# Altium project ESP-Logger.PrjPcb
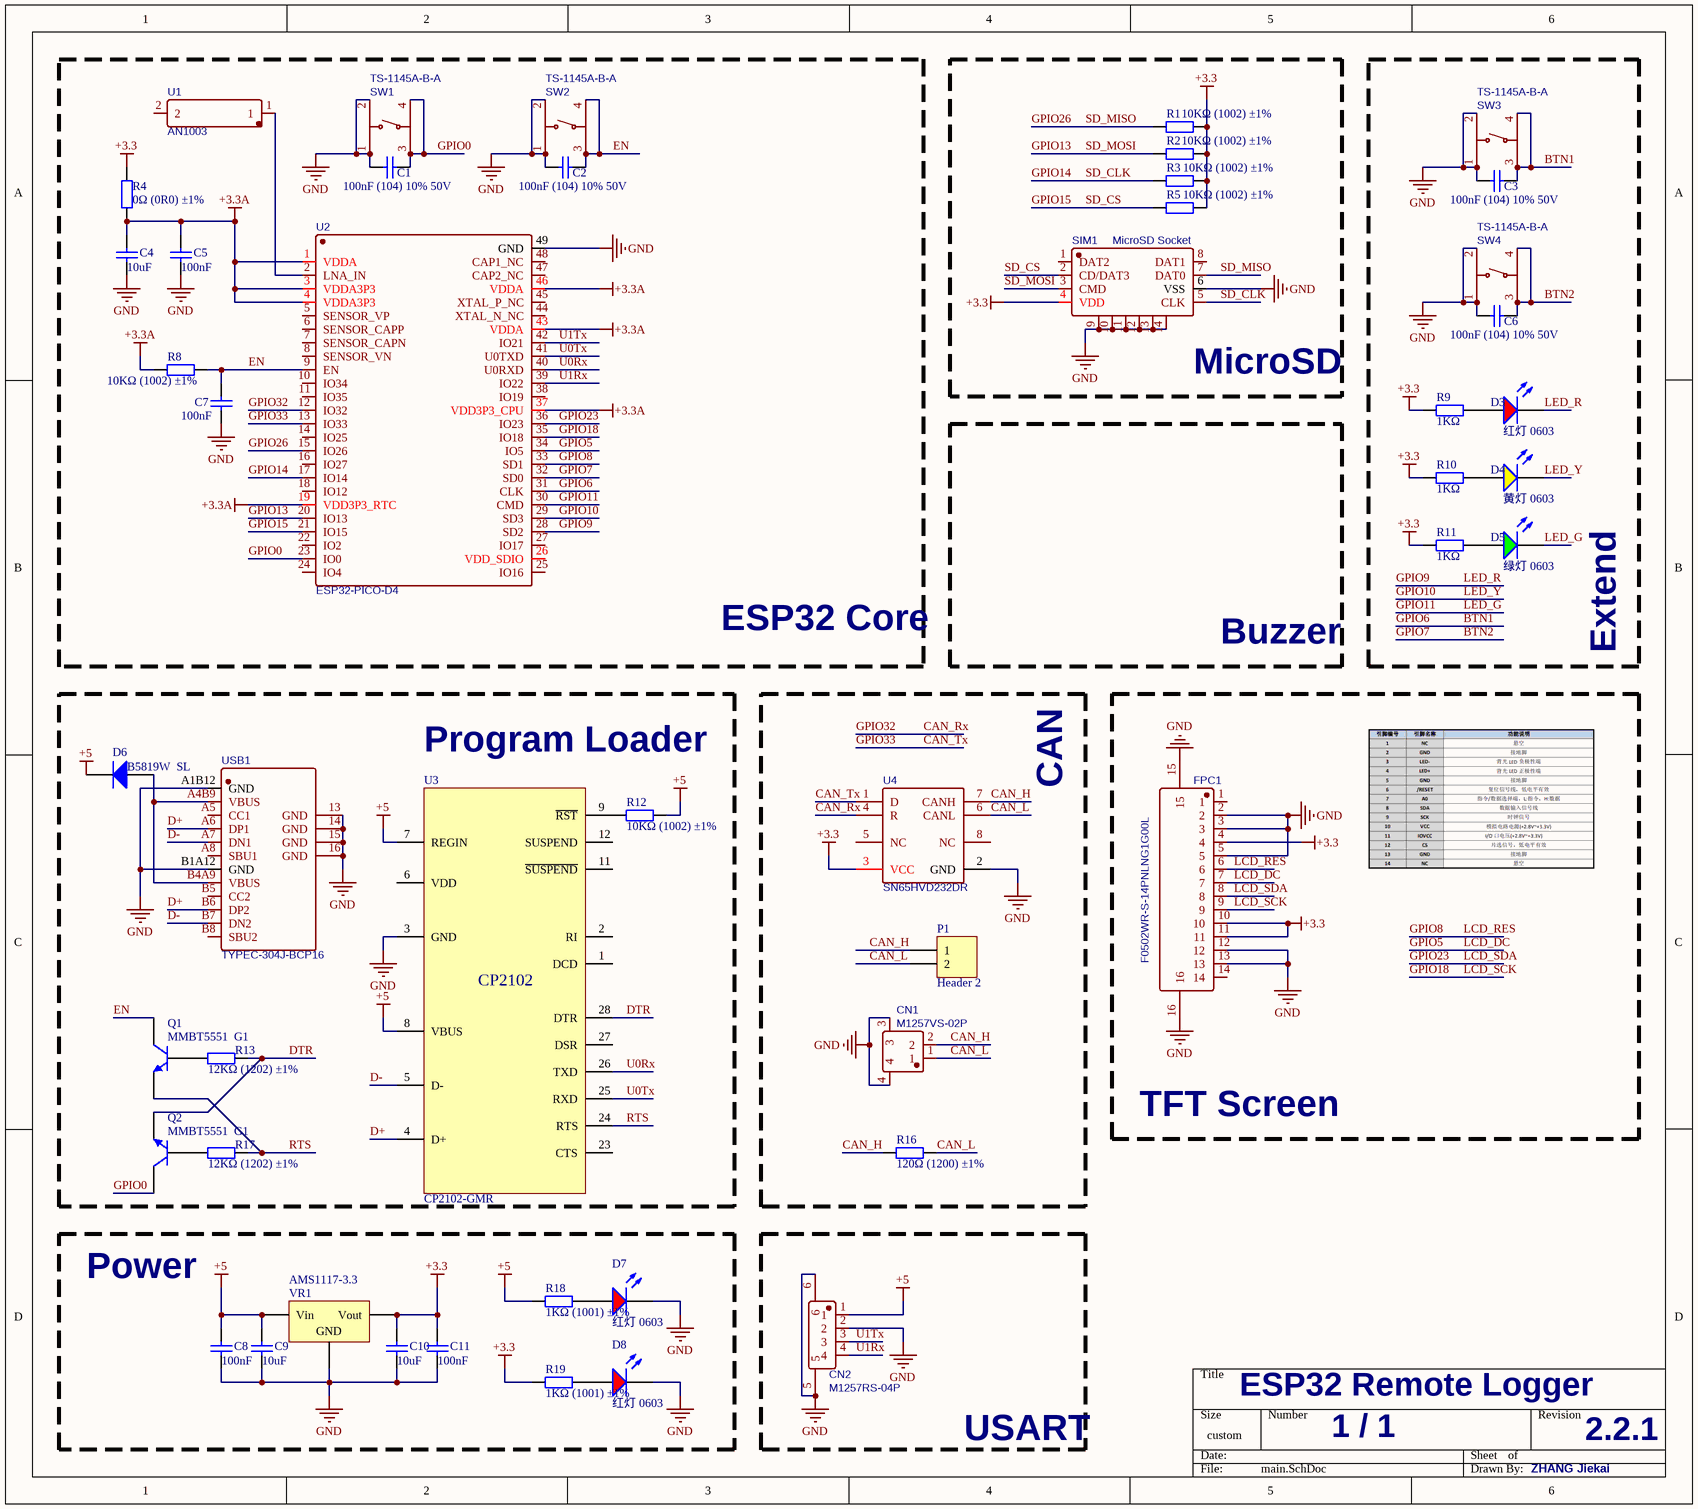
[diagram p0: main.SchDoc]
1 sheet, 49 parts. Net scope: global (net labels, ports and power ports of the same name join across sheets).
Board files: gen1.PcbDoc, gen2.PcbDoc

## Sheet main.SchDoc
size 317 x 281 mm; SheetNumber: 1; SheetTotal: 1

### Parts
C1  100nF (104) 10% 50V  [0603_C]
C2  100nF (104) 10% 50V  [0603_C]
C3  100nF (104) 10% 50V  [0603_C]
C4  10uF  [0603_C]
C5  100nF  [0603_C]
C6  100nF (104) 10% 50V  [0603_C]
C7  100nF  [0603_C]
C8  100nF  [0603_C]
C9  10uF  [0603_C]
C10  10uF  [0603_C]
C11  100nF  [0603_C]
CN1  M1257VS-02P  [CONN-SMD_P1.25_M1257VS-02P]
CN2  M1257RS-04P  [CONN-SMD_M1257RS-04P]
D3  红灯 0603  [0603_LED_S1]
D4  黄灯 0603  [0603_LED_S1]
D5  绿灯 0603  [0603_LED_S1]
D6  B5819W  SL  [SOD-123]
D7  红灯 0603  [0603_LED_S1]
D8  红灯 0603  [0603_LED_S1]
FPC1  F0502WR-S-14PNLNG1G00L  [FPC-SMD_P0.50-14P_F0500WR-S]
P1  Header 2  [HDR1X2]
Q1  MMBT5551  G1  [SOT-23(SOT-23-3)]
Q2  MMBT5551  G1  [SOT-23(SOT-23-3)]
R1  10KΩ (1002) ±1%  [0603_R]
R2  10KΩ (1002) ±1%  [0603_R]
R3  10KΩ (1002) ±1%  [0603_R]
R4  0Ω (0R0) ±1%  [0603_R]
R5  10KΩ (1002) ±1%  [0603_R]
R8  10KΩ (1002) ±1%  [0603_R]
R9  1KΩ  [0603_R]
R10  1KΩ  [0603_R]
R11  1KΩ  [0603_R]
R12  10KΩ (1002) ±1%  [0603_R]
R13  12KΩ (1202) ±1%  [0603_R]
R16  120Ω (1200) ±1%  [0603_R]
R17  12KΩ (1202) ±1%  [0603_R]
R18  1KΩ (1001) ±1%  [0603_R]
R19  1KΩ (1001) ±1%  [0603_R]
SIM1  MicroSD Socket  [SIM-SMD_8P-1040310811]
SW1  TS-1145A-B-A  [SW-SMD_4P-L4.2-W3.2-P2.15-LS5.2]
SW2  TS-1145A-B-A  [SW-SMD_4P-L4.2-W3.2-P2.15-LS5.2]
SW3  TS-1145A-B-A  [SW-SMD_4P-L4.2-W3.2-P2.15-LS5.2]
SW4  TS-1145A-B-A  [SW-SMD_4P-L4.2-W3.2-P2.15-LS5.2]
U1  AN1003  [ANT-SMD_L10.3-W3.0]
U2  ESP32-PICO-D4  [QFN-48_L7.0-W7.0-P0.50-BL-EP5.4]
U3  CP2102-GMR  [QFN-28_5x5x05P]
U4  SN65HVD232DR  [SOIC-8_L5.0-W4.0-P1.27-LS6.0-BL]
USB1  TYPEC-304J-BCP16  [USB-C-SMD_TYPEC-304J-BCP16]
VR1  AMS1117-3.3  [SOT-223]

### Blocks framed on the sheet
ESP32 Core: C1 C2 C4 C5 C7 R4 R8 SW1 SW2 U1 U2
MicroSD: R1-R3 R5 SIM1
Extend: C3 C6 D3-D5 R9-R11 SW3 SW4
Program Loader: D6 Q1 Q2 R12 R13 R17 U3 USB1
CAN: CN1 P1 R16 U4
TFT Screen: FPC1
Power: C8-C11 D7 D8 R18 R19 VR1
USART: CN2

### Nets
+3.3: C10.2 C11.2 FPC1.4 FPC1.10 FPC1.11 R1.2 R2.2 R3.2 R4.2 R5.2 R9.2 R10.2 R11.2 R19.1 SIM1.4(VDD) U4.3(VCC) VR1.2(Vout)
+3.3A: C4.2 C5.2 R4.1 R8.1 U2.1(VDDA) U2.3(VDDA3P3) U2.4(VDDA3P3) U2.19(VDD3P3_RTC) U2.37(VDD3P3_CPU) U2.43(VDDA) U2.46(VDDA)
+5: C8.2 C9.2 CN2.1 D6.2(K) R12.2 R18.1 U3.7(REGIN) U3.8(VBUS) VR1.3(Vin)
GND: C1.1 C2.1 C3.1 C4.1 C5.1 C6.1 C7.1 C8.1 C9.1 C10.1 C11.1 CN1.3 CN1.4 CN2.2 CN2.5 CN2.6 D7.K D8.K FPC1.2 FPC1.3 FPC1.5 FPC1.12 FPC1.13 FPC1.15 FPC1.16 SIM1.6(VSS) SIM1.9 SIM1.10 SIM1.11 SIM1.12 SIM1.13 SIM1.14 SW1.1 SW1.2 SW2.1 SW2.2 SW3.1 SW3.2 SW4.1 SW4.2 U2.49(GND) U3.3(GND) U4.2(GND) USB1.13(GND) USB1.14(GND) USB1.15(GND) USB1.16(GND) USB1.A1B12(GND) USB1.B1A12(GND) VR1.1(GND)
BTN1: C3.2 SW3.3 SW3.4 U2.31(CLK)  [also labelled GPIO6]
BTN2: C6.2 SW4.3 SW4.4 U2.32(SD0)  [also labelled GPIO7]
CAN_H: CN1.2 P1.1 R16.1 U4.7(CANH)
CAN_L: CN1.1 P1.2 R16.2 U4.6(CANL)
CAN_Rx: U2.12(IO32) U4.4(R)  [also labelled GPIO32]
CAN_Tx: U2.13(IO33) U4.1(D)  [also labelled GPIO33]
D+: U3.4(D+) USB1.A6(DP1) USB1.B6(DP2)
D-: U3.5(D-) USB1.A7(DN1) USB1.B7(DN2)
DTR: Q2.2(E) R13.2 U3.28(DTR)
EN: C2.2 C7.2 Q1.3(C) R8.2 SW2.3 SW2.4 U2.9(EN)
GPIO0: C1.2 Q2.3(C) SW1.3 SW1.4 U2.23(IO0)
GPIO5: FPC1.7 U2.34(IO5)  [also labelled LCD_DC]
GPIO8: FPC1.6 U2.33(SD1)  [also labelled LCD_RES]
GPIO9: D3.K U2.28(SD2)  [also labelled LED_R]
GPIO10: D4.K U2.29(SD3)  [also labelled LED_Y]
GPIO11: D5.K U2.30(CMD)  [also labelled LED_G]
GPIO13: R2.1 SIM1.3(CMD) U2.20(IO13)  [also labelled SD_MOSI]
GPIO14: R3.1 SIM1.5(CLK) U2.17(IO14)  [also labelled SD_CLK]
GPIO15: R5.1 SIM1.2(CD/DAT3) U2.21(IO15)  [also labelled SD_CS]
GPIO18: FPC1.9 U2.35(IO18)  [also labelled LCD_SCK]
GPIO23: FPC1.8 U2.36(IO23)  [also labelled LCD_SDA]
GPIO26: R1.1 SIM1.7(DAT0) U2.15(IO26)  [also labelled SD_MISO]
RTS: Q1.2(E) R17.2 U3.24(RTS)
U0Rx: U2.40(U0RXD) U3.26(TXD)
U0Tx: U2.41(U0TXD) U3.25(RXD)
U1Rx: CN2.4 U2.39(IO22)
U1Tx: CN2.3 U2.42(IO21)
NetD3_A: D3.A R9.1
NetD4_A: D4.A R10.1
NetD5_A: D5.A R11.1
NetD6_1: D6.1(A) USB1.A4B9(VBUS) USB1.B4A9(VBUS)
NetD7_A: D7.A R18.2
NetD8_A: D8.A R19.2
NetQ1_1: Q1.1(B) R13.1
NetQ2_1: Q2.1(B) R17.1
NetR12_1: R12.1 U3.9(~{RST})
NetU1_1: U1.1 U2.2(LNA_IN)

Not connected (* = marked no-connect by the designer): FPC1 1 14; SIM1 1(DAT2) 8(DAT1); U1 2; U2 5(SENSOR_VP) 6(SENSOR_CAPP) 7(SENSOR_CAPN) 8(SENSOR_VN) 10(IO34) 11(IO35) 14(IO25) 16(IO27) 18(IO12) 22(IO2) 24(IO4) 25(IO16) 26(VDD_SDIO) 27(IO17) 38(IO19) 44(XTAL_N_NC) 45(XTAL_P_NC) 47(CAP2_NC) 48(CAP1_NC); U3 1(DCD) 2(RI) 6(VDD) 11(~{SUSPEND}) 12(SUSPEND) 23(CTS) 27(DSR); U4 5(NC) 8(NC); USB1 A5(CC1) A8(SBU1) B5(CC2) B8(SBU2)

### Notes on the sheet
- Buzzer
- ESP32 Remote Logger
- 1 / 1
- 2.2.1
- ZHANG Jiekai
- (in symbol CP2102-GMR_[C6568]) CP2102

### Library data of the parts
C1-C3 C5-C8 C11 = 0603 100nF (104) 10% 50V: 贴片电容; ComponentLink1Description: 供应商链接; ComponentLink1URL: http://www.szlcsc.com/product/details_15331.html; Package: 0603; Supplier: LC; SuppliersPartNumber: C14663
C4 C9 C10 = 0603 10uF (106) 10% 10V: 贴片电容; ComponentLink1Description: 供应商链接; ComponentLink1URL: http://www.szlcsc.com/product/details_20411.html; Package: 0603; Supplier: LC; SuppliersPartNumber: C19702
CN1 = M1257VS-02P: BOM_Manufacturer: XFCN; Contributor: LCSC; BOM_Supplier: LCSC; BOM_Supplier Part: C541819; BOM_Manufacturer Part: M1257VS-02P; BOM_JLCPCB Part Class: Extended Part; spicePre: C; spiceSymbolName: M1257VS-02P
CN2 = M1257RS-04P: BOM_Manufacturer: XFCN; Contributor: LCSC; BOM_Supplier: LCSC; BOM_Supplier Part: C541828; BOM_Manufacturer Part: M1257RS-04P; BOM_JLCPCB Part Class: Extended Part; spicePre: C; spiceSymbolName: M1257RS-04P
D3 D7 D8 = 0603 红灯: 发光二极管; ComponentLink1Description: 供应商链接; ComponentLink1URL: http://www.szlcsc.com/product/details_2659.html; Package: 0603; Supplier: LC; SuppliersPartNumber: C2286
D4 = 0603 黄灯: 发光二极管; ComponentLink1Description: 供应商链接; ComponentLink1URL: http://www.szlcsc.com/product/details_73147.html; Package: 0603; Supplier: LC; SuppliersPartNumber: C72038
D5 = 0603 绿灯: 发光二极管; ComponentLink1Description: 供应商链接; ComponentLink1URL: http://www.szlcsc.com/product/details_73152.html; Package: 0603; Supplier: LC; SuppliersPartNumber: C72043
D6 = SOD-123 B5819W  SL: 肖特基二极管; ComponentLink1Description: 供应商链接; ComponentLink1URL: http://www.szlcsc.com/product/details_9093.html; Package: SOD-123; Supplier: LC; SuppliersPartNumber: C8598
FPC1 = F0502WR-S-14PNLNG1G00L: BOM_Manufacturer: Joint Tech Elec; Contributor: LCSC; BOM_Supplier: LCSC; BOM_Supplier Part: C247902; BOM_Manufacturer Part: F0502WR-S-14PNLNG1G00L; BOM_JLCPCB Part Class: Extended Part; spicePre: F; spiceSymbolName: F0502WR-S-14PNLNG1G00L
P1 = Header 2: Header, 2-Pin; LatestRevisionDate: 17-Jul-2002; LatestRevisionNote: Re-released for DXP Platform.; Publisher: Altium Limited
Q1 Q2 = SOT-23 MMBT5551  G1: 三极管; ComponentLink1Description: 供应商链接; ComponentLink1URL: http://www.szlcsc.com/product/details_2502.html; Package: SOT-23; Supplier: LC; SuppliersPartNumber: C2145
R1-R3 R5 R8 R12 = 0603 10KΩ (1002) 1%: 贴片电阻; ComponentLink1Description: 供应商链接; ComponentLink1URL: http://www.szlcsc.com/product/details_26547.html; Package: 0603; Supplier: LC; SuppliersPartNumber: C25804
R4 = 0603 0Ω (0R0) 1%: 贴片电阻; ComponentLink1Description: 供应商链接; ComponentLink1URL: http://www.szlcsc.com/product/details_21903.html; Package: 0603; Supplier: LC; SuppliersPartNumber: C21189
R9-R11 R18 R19 = 0603 1KΩ (1001) 1%: 贴片电阻; ComponentLink1Description: 供应商链接; ComponentLink1URL: http://www.szlcsc.com/product/details_21904.html; Package: 0603; Supplier: LC; SuppliersPartNumber: C21190
R13 R17 = 0603 12KΩ (1202) 1%: 贴片电阻; ComponentLink1Description: 供应商链接; ComponentLink1URL: http://www.szlcsc.com/product/details_23517.html; Package: 0603; Supplier: LC; SuppliersPartNumber: C22790
R16 = 0603 120Ω (1200) 1%: 贴片电阻; ComponentLink1Description: 供应商链接; ComponentLink1URL: http://www.szlcsc.com/product/details_23514.html; Package: 0603; Supplier: LC; SuppliersPartNumber: C22787
SIM1 = 1040310811: BOM_Manufacturer: MOLEX; Contributor: LCSC; BOM_Supplier: LCSC; BOM_Supplier Part: C585350; BOM_Manufacturer Part: 1040310811; BOM_JLCPCB Part Class: Extended Part; spicePre: S; spiceSymbolName: 1040310811
SW1-SW4 = TS-1145A-B-A: BOM_Manufacturer: XKB Enterprise; Contributor: LCSC; BOM_Supplier: LCSC; BOM_Supplier Part: C318904; BOM_Manufacturer Part: TS-1145A-B-A; BOM_JLCPCB Part Class: Extended Part; spicePre: S; spiceSymbolName: TS-1145A-B-A
U1 = AN1003: BOM_Manufacturer: Rainsun microwave Tech; Contributor: LCSC; BOM_Supplier: LCSC; BOM_Supplier Part: C239240; BOM_Manufacturer Part: AN1003; BOM_JLCPCB Part Class: Extended Part; spicePre: U; spiceSymbolName: AN1003
U2 = ESP32-PICO-D4: BOM_Manufacturer: Espressif Systems; Contributor: LCSC; BOM_Supplier: LCSC; BOM_Supplier Part: C193707; BOM_Manufacturer Part: ESP32-PICO-D4; BOM_JLCPCB Part Class: Extended Part; spicePre: U; spiceSymbolName: ESP32-PICO-D4
U3 = CP2102-GMR_[C6568]: USB; ComponentLink1Description: 供应商链接; ComponentLink1URL: http://www.szlcsc.com/product/details_7033.html; Package: QFN-28_5x5x05P; Supplier: LC; SuppliersPartNumber: C6568
U4 = SN65HVD232DR: BOM_Manufacturer: TI; BOM_Supplier: LCSC; BOM_Manufacturer Part: SN65HVD232DR; BOM_Supplier Part: C30530; BOM_JLCPCB Part Class: Extended Part; spicePre: U; spiceSymbolName: SN65HVD232DR
USB1 = TYPEC-304J-BCP16: BOM_Manufacturer: XUNPU(讯普); Contributor: LCSC; BOM_Supplier: LCSC; BOM_Supplier Part: C2835315; BOM_Manufacturer Part: TYPEC-304J-BCP16; BOM_JLCPCB Part Class: Extended Part; spicePre: U; spiceSymbolName: TYPEC-304J-BCP16
VR1 = SOT-223 AMS1117-3.3: 低压差线性稳压(LDO); ComponentLink1Description: 供应商链接; ComponentLink1URL: http://www.szlcsc.com/product/details_6652.html; Package: SOT-223; Supplier: LC; SuppliersPartNumber: C6186